# EasyEDA schematic Schematic diagram-EDA.json
TITLE: 课设 copy; REV: 1.0; Date: 2024-01-13; Sheet: 1/1; Drawn By: rxiwei; Company: 立创EDA
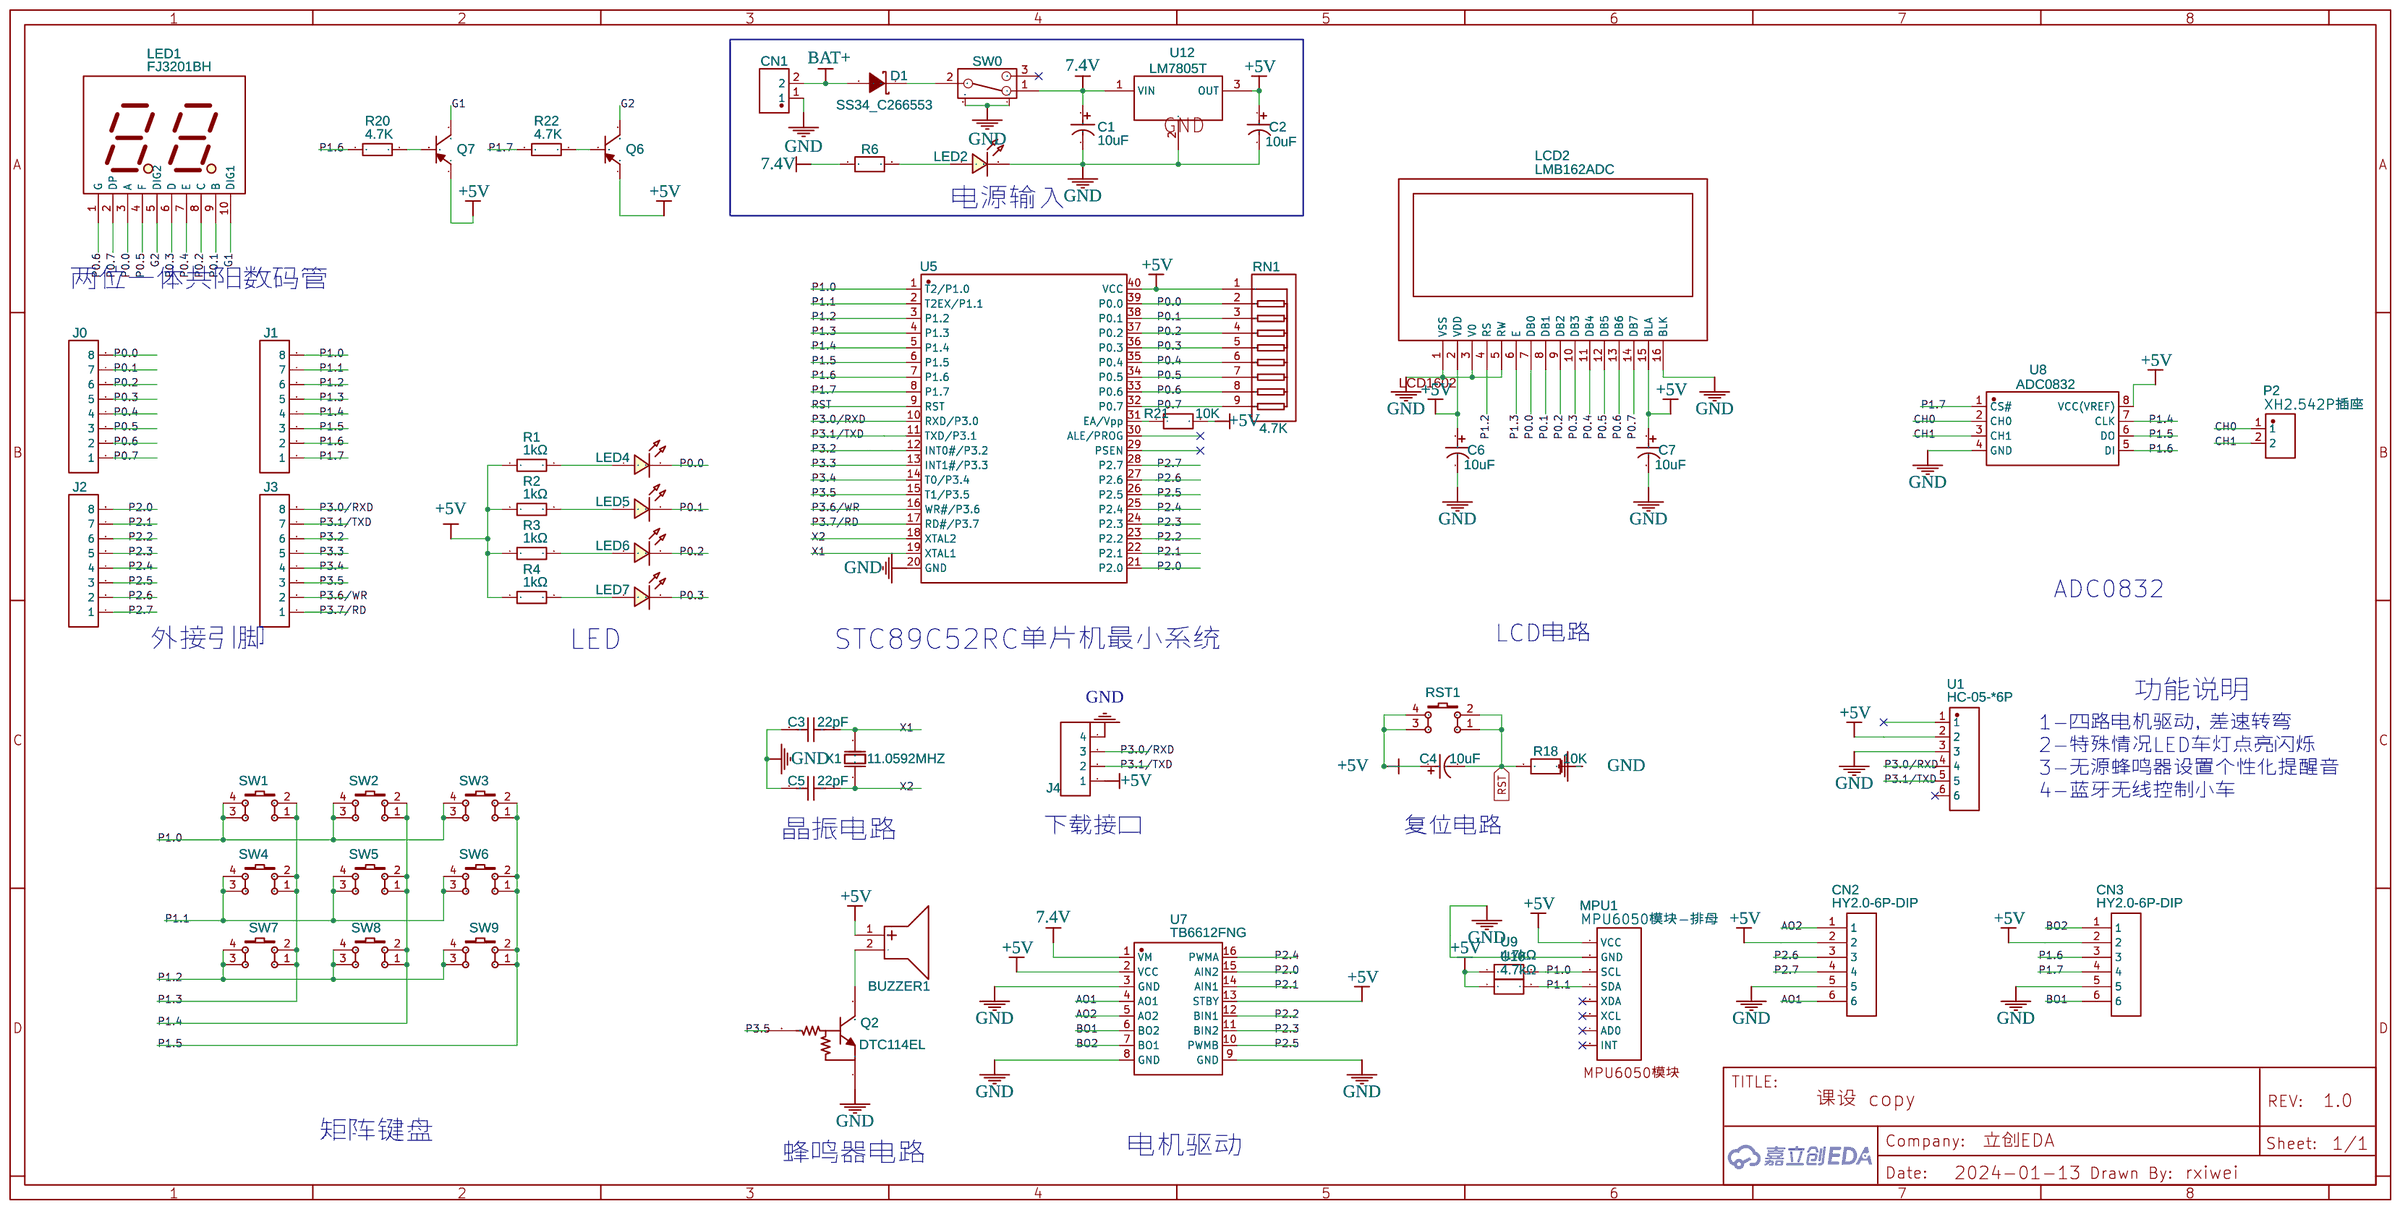
[diagram p0: schematic sheet]

## Parts
BUZZER1  YS-MBZ9042C05R42  [BUZ-TH_BD9.0-P4.00-D0.6-FD]
C1  10uF  [CAP-TH_BD4.0-P1.50-D0.8-FD]
C2  10uF  [CAP-TH_BD4.0-P1.50-D0.8-FD]
C3  22pF  [CAP-TH_L6.5-W3.5-P5.00-D1.2]
C4  10uF  [CAP-TH_BD4.0-P1.50-D0.8-FD]
C5  22pF  [CAP-TH_L6.5-W3.5-P5.00-D1.2]
C6  10uF  [CAP-TH_BD4.0-P1.50-D0.8-FD]
C7  10uF  [CAP-TH_BD4.0-P1.50-D0.8-FD]
CN1  XH-2A_C722856  [CONN-TH_XH-2A_C722856]
CN2  HY2.0-6P-DIP  [HY2.0-6P-DIP]
CN3  HY2.0-6P-DIP  [HY2.0-6P-DIP]
D1  SS34_C266553  [SMA_L4.4-W2.8-LS5.4-RD]
J0  HDR-M-2.54_1x8  [HDR-M-2.54_1X8]
J1  HDR-M-2.54_1x8  [HDR-M-2.54_1X8]
J2  HDR-M-2.54_1x8  [HDR-M-2.54_1X8]
J3  HDR-M-2.54_1x8  [HDR-M-2.54_1X8]
J4  HDR-M-2.54_1x4  [HDR-M-2.54_1X4]
LCD2  LMB162ADC  [LCD1602]
LED1  FJ3201BH  [LED-SEG-TH_10P-L15.5-W15.0-P2.54-LS10.16-BL]
LED2  LED-TH-3mm_R  [LED-TH_BD3.0_RED]
LED4  LED-TH-3mm_R  [LED-TH_BD3.0_RED]
LED5  LED-TH-3mm_R  [LED-TH_BD3.0_RED]
LED6  LED-TH-3mm_R  [LED-TH_BD3.0_RED]
LED7  LED-TH-3mm_R  [LED-TH_BD3.0_RED]
MPU1  MPU6050模块-排母  [MPU6050模块-排母-PCB]
P2  XH2.542P插座  [CONN-TH_XH2.54-2P]
Q2  DTC114EL  [TO-92-3_L4.9-W3.7-P1.27-L]
Q6  2N3906(SOT-23)  [SOT-23-3_L2.9-W1.6-P1.90-LS2.8-TR-CW]
Q7  2N3906(SOT-23)  [SOT-23-3_L2.9-W1.6-P1.90-LS2.8-TR-CW]
R1  1kΩ  [RES-TH_BD5.0-L15.5-P19.50-D0.7]
R2  1kΩ  [RES-TH_BD5.0-L15.5-P19.50-D0.7]
R3  1kΩ  [RES-TH_BD5.0-L15.5-P19.50-D0.7]
R4  1kΩ  [RES-TH_BD5.0-L15.5-P19.50-D0.7]
R6  10K  [RES-TH_BD2.4-L6.3-P10.30-D0.6]
R18  10K  [RES-TH_BD2.4-L6.3-P10.30-D0.6]
R20  4.7K  [RES-TH_BD3.5-L9.0-P13.00-D0.8]
R21  10K  [RES-TH_BD2.4-L6.3-P10.30-D0.6]
R22  4.7K  [RES-TH_BD3.5-L9.0-P13.00-D0.8]
RN1  4.7K  [RES-ARRAY-TH_9P-P2.54-D1.0]
RST1  K4-6×6_TH  [KEY-TH_4P-L6.0-W6.0-P4.50-LS6.5]
SW0  SK-12E12-G5  [SW-TH_SK-12E12-G5]
SW1  K4-6×6_TH  [KEY-TH_4P-L6.0-W6.0-P4.50-LS6.5]
SW2  K4-6×6_TH  [KEY-TH_4P-L6.0-W6.0-P4.50-LS6.5]
SW3  K4-6×6_TH  [KEY-TH_4P-L6.0-W6.0-P4.50-LS6.5]
SW4  K4-6×6_TH  [KEY-TH_4P-L6.0-W6.0-P4.50-LS6.5]
SW5  K4-6×6_TH  [KEY-TH_4P-L6.0-W6.0-P4.50-LS6.5]
SW6  K4-6×6_TH  [KEY-TH_4P-L6.0-W6.0-P4.50-LS6.5]
SW7  K4-6×6_TH  [KEY-TH_4P-L6.0-W6.0-P4.50-LS6.5]
SW8  K4-6×6_TH  [KEY-TH_4P-L6.0-W6.0-P4.50-LS6.5]
SW9  K4-6×6_TH  [KEY-TH_4P-L6.0-W6.0-P4.50-LS6.5]
U1  HC-05-*6P  [HDR-TH_6P-P2.50-V-F-R1-C6]
U5  STC89C52RC-40I  [DIP-40_L50.8-W17.8-P2.54-LS15.2-BL]
U7  TB6612FNG  [TB6612FNG]
U8  ADC0832  [PDIP-8_L9.6-W6.4-P2.54-LS7.6-BL]
U9  4.7kΩ  [RES-TH_BD5.0-L15.5-P19.50-D0.8]
U10  4.7kΩ  [RES-TH_BD5.0-L15.5-P19.50-D0.8]
U12  LM7805T  [TO-220-3_L10.0-W4.5-P2.54-L]
X1  11.0592MHZ  [HC-49US_L11.5-W4.5-P4.88]

## Library data of the parts
BUZZER1 = YS-MBZ9042C05R42: Supplier: LCSC; Supplier Part: C409837; Manufacturer: Fengming; Contributor: LCSC; JLCPCB Part Class: Extended Part
C1 C2 C4 C6 C7 = 10uF 25V 4*7: Supplier: LCSC; Manufacturer: ValuePro; Supplier Part: C43351; JLCPCB Part Class: Extended Part
C3 C5 = CC81-N5U2J1B220KSEW: Supplier: LCSC; Contributor: LCSC
CN1 = XH-2A_C722856: Supplier: LCSC; Supplier Part: C722856; Manufacturer: CAX; Manufacturer Part: XH-2A; Contributor: LCSC; JLCPCB SMD: Yes; SMT Type: Extend
CN2 CN3 = HY2.0-6P-DIP: Contributor: ffffish
D1 = SS34_C266553: Supplier: LCSC; Supplier Part: C266553; Manufacturer: Bourne Semicon (Shenzhen); Manufacturer Part: SS34; Contributor: LCSC; JLCPCB Part Class: Extended Part
J0-J3 = HDR-M-2.54_1x8: Supplier Part: C190820; Supplier: LCSC; Contributor: LCEDA_Lib
J4 = HDR-M-2.54_1x4: Supplier Part: C124378; Supplier: LCSC; Contributor: LCEDA_Lib
LCD2 = LMB162ADC: Supplier: LCSC; Manufacturer: TOPWAY; Supplier Part: C9741; JLCPCB Part Class: Extended Part; Package Display: Yes
LED1 = FJ3201BH: Contributor: LCSC; Supplier: LCSC; Supplier Part: C2938333; Manufacturer: 志浩; JLCPCB Part Class: Extended Part
LED2 LED4-LED7 = LED-TH-3mm_R: Manufacturer: EVERLIGHT(台湾亿光); Manufacturer Part: 204-10SDRD/S530-A3-L; Supplier Part: C84774; Supplier: LCSC; Contributor: LCEDA_Lib
MPU1 = MPU6050模块-排母: Contributor: buildy
P2 = XH2.542P插座: Contributor: lcsc; Supplier: LCSC; Supplier Part: C9900016948; Manufacturer: null; JLCPCB Part Class: Extended Part
Q2 = DTC114EL-T92-K: Supplier: LCSC; Manufacturer: UTC; Contributor: 立创EDA课程案例推荐; Supplier Part: C171504; JLCPCB Part Class: Extended Part
Q6 Q7 = 2N3906(SOT-23): Supplier: LCSC; Manufacturer: KEC; Manufacturer Part: 2N3906S-RTK/PS; Contributor: LCEDA_Lib; Supplier Part: C147294
R1-R4 = MOF3WS-1KΩ±5%T: Contributor: lcsc; Supplier: LCSC; Supplier Part: C714451; Manufacturer: 华星机电; JLCPCB Part Class: Extended Part
R6 R18 R21 = RN 1/4W 10K F T/B A1: Supplier: LCSC; Supplier Part: C410695; Manufacturer: TyoHM; Contributor: LCSC; JLCPCB Part Class: Extended Part
R20 R22 = RSS02J1001A520NH: Supplier: LCSC; Supplier Part: C274850; Manufacturer: Futaba Elec; Contributor: LCSC
RN1 = A09-472JP: Supplier: LCSC; Manufacturer: FH; Supplier Part: C9112; JLCPCB Part Class: Extended Part
RST1 SW1-SW9 = K4-6×6_TH: Supplier: LCSC; Supplier Part: C136684; Manufacturer: 韩国韩荣; Manufacturer Part: K2-1102DP-E4SW-04; Contributor: LCEDA_Lib
SW0 = SK-12E12-G5: Supplier: LCSC; Supplier Part: C136720; Manufacturer: Rectangular Connectors - Contacts; Contributor: LCSC
U1 = HC-05-*6P: Contributor: LCSC; Supplier: LCSC; Supplier Part: C9900003093; Manufacturer: null; Manufacturer Part: HC-05_排母*6P; JLCPCB Part Class: Extended Part
U5 = STC89C52RC-40I: Supplier: LCSC; Manufacturer: STC; Supplier Part: C14022; JLCPCB Part Class: Extended Part
U7 = TB6612FNG: Contributor: heiweilu
U8 = ADC0832CCN/NOPB: Contributor: LCSC; Supplier: LCSC; Supplier Part: C385862; Manufacturer: TI(德州仪器); JLCPCB Part Class: Extended Part
U9 U10 = FMF200FRE73-4K7: Contributor: lcsc; Supplier: LCSC; Supplier Part: C1765785; Manufacturer: YAGEO(国巨)
U12 = LM7805T: Supplier: LCSC; Supplier Part: C507145; Manufacturer: HGC(Huaguan Semicon); Contributor: LCSC; JLCPCB Part Class: Extended Part
X1 = XIHCCCNANF-11.0592: Supplier: LCSC; Supplier Part: C358645; Manufacturer: TAITIEN Elec; Contributor: LCSC; JLCPCB Part Class: Extended Part

## Nets
7.4V: C1.1 R6.1 SW0.1 U7.1(VM) U12.1(VIN)
+5V: BUZZER1.1(+) C2.1 C4.1 C6.1 C7.1 CN2.2 CN3.2 J4.1 LCD2.2(VDD) LCD2.15(BLA) MPU1.1(VCC) Q6.1(E) Q7.1(E) R1.1 R2.1 R3.1 R4.1 R21.2 RN1.1 RST1.3 RST1.4 U1.2 U5.40(VCC) U7.2(VCC) U7.13(STBY) U8.8(VCC(VREF)) U9.1 U10.1 U12.3(OUT)
GND: C1.2 C2.2 C3.2 C5.2 C6.2 C7.2 CN1.1 CN2.5 CN3.5 J4.4 LCD2.1(VSS) LCD2.3(V0) LCD2.5(RW) LCD2.16(BLK) LED2.2 MPU1.2(GND) Q2.1(E) R18.1 SW0.4 SW0.5 U1.3 U5.20(GND) U7.3(GND) U7.8(GND) U7.9(GND) U8.4(GND) U12.2(GND)
AO1: CN2.6 U7.4(AO1)
AO2: CN2.1 U7.5(AO2)
BAT+: CN1.2 D1.2(A)
BO1: CN3.6 U7.6(BO2)
BO2: CN3.1 U7.7(BO1)
CH0: P2.1 U8.2(CH0)
CH1: P2.2 U8.3(CH1)
G1: LED1.10(DIG1) Q7.3(C)
G2: LED1.5(DIG2) Q6.3(C)
P0.0: J0.8 LCD2.7(DB0) LED1.3(A) LED4.2 RN1.2 U5.39(P0.0)
P0.1: J0.7 LCD2.8(DB1) LED1.9(B) LED5.2 RN1.3 U5.38(P0.1)
P0.2: J0.6 LCD2.9(DB2) LED1.8(C) LED6.2 RN1.4 U5.37(P0.2)
P0.3: J0.5 LCD2.10(DB3) LED1.6(D) LED7.2 RN1.5 U5.36(P0.3)
P0.4: J0.4 LCD2.11(DB4) LED1.7(E) RN1.6 U5.35(P0.4)
P0.5: J0.3 LCD2.12(DB5) LED1.4(F) RN1.7 U5.34(P0.5)
P0.6: J0.2 LCD2.13(DB6) LED1.1(G) RN1.8 U5.33(P0.6)
P0.7: J0.1 LCD2.14(DB7) LED1.2(DP) RN1.9 U5.32(P0.7)
P1.0: J1.8 MPU1.3(SCL) SW1.3 SW1.4 SW2.3 SW2.4 SW3.3 SW3.4 U5.1(T2/P1.0) U9.2
P1.1: J1.7 MPU1.4(SDA) SW4.3 SW4.4 SW5.3 SW5.4 SW6.3 SW6.4 U5.2(T2EX/P1.1) U10.2
P1.2: J1.6 LCD2.4(RS) SW7.3 SW7.4 SW8.3 SW8.4 SW9.3 SW9.4 U5.3(P1.2)
P1.3: J1.5 LCD2.6(E) SW1.1 SW1.2 SW4.1 SW4.2 SW7.1 SW7.2 U5.4(P1.3)
P1.4: J1.4 SW2.1 SW2.2 SW5.1 SW5.2 SW8.1 SW8.2 U5.5(P1.4) U8.7(CLK)
P1.5: J1.3 SW3.1 SW3.2 SW6.1 SW6.2 SW9.1 SW9.2 U5.6(P1.5) U8.6(DO)
P1.6: CN3.3 J1.2 R20.2 U5.7(P1.6) U8.5(DI)
P1.7: CN3.4 J1.1 R22.2 U5.8(P1.7) U8.1(CS#)
P2.0: J2.8 U5.21(P2.0) U7.15(AIN2)
P2.1: J2.7 U5.22(P2.1) U7.14(AIN1)
P2.2: J2.6 U5.23(P2.2) U7.12(BIN1)
P2.3: J2.5 U5.24(P2.3) U7.11(BIN2)
P2.4: J2.4 U5.25(P2.4) U7.16(PWMA)
P2.5: J2.3 U5.26(P2.5) U7.10(PWMB)
P2.6: CN2.3 J2.2 U5.27(P2.6)
P2.7: CN2.4 J2.1 U5.28(P2.7)
P3.0/RXD: J3.8 J4.3 U1.4 U5.10(RXD/P3.0)
P3.1/TXD: J3.7 J4.2 U1.5 U5.11(TXD/P3.1)
P3.2: J3.6 U5.12(INT0#/P3.2)
P3.3: J3.5 U5.13(INT1#/P3.3)
P3.4: J3.4 U5.14(T0/P3.4)
P3.5: J3.3 Q2.3(B) U5.15(T1/P3.5)
P3.6/WR: J3.2 U5.16(WR#/P3.6)
P3.7/RD: J3.1 U5.17(RD#/P3.7)
RST: C4.2 R18.2 RST1.1 RST1.2 U5.9(RST)
X1: C3.1 U5.19(XTAL1) X1.2(OSC2)
X2: C5.1 U5.18(XTAL2) X1.1(OSC1)
Net-(BUZZER1-2): BUZZER1.2(-) Q2.2(C)
Net-(D1-1): D1.1(C) SW0.2
Net-(LED2-1): LED2.1 R6.2
Net-(LED4-1): LED4.1 R1.2
Net-(LED5-1): LED5.1 R2.2
Net-(LED6-1): LED6.1 R3.2
Net-(LED7-1): LED7.1 R4.2
Net-(Q6-2): Q6.2(B) R22.1
Net-(Q7-2): Q7.2(B) R20.1
Net-(R21-1): R21.1 U5.31(EA/Vpp)

Not connected (* = marked no-connect by the designer): MPU1 5(XDA)* 6(XCL)* 7(AD0)* 8(INT)*; SW0 3*; U1 1 6*; U5 29(PSEN) 30(ALE/PROG)

## Notes on the sheet
- 电源输入
- 两位一体共阳数码管
- ADC0832
- LCD电路
- 外接引脚
- LED
- STC89C52RC单片机最小系统
- 功能说明
- 1-四路电机驱动，差速转弯
  2-特殊情况LED车灯点亮闪烁
  3-无源蜂鸣器设置个性化提醒音
  4-蓝牙无线控制小车
- 晶振电路
- 下载接口
- 复位电路
- 矩阵键盘
- 蜂鸣器电路
- 电机驱动
